# Altium project ac-control.PrjPcb
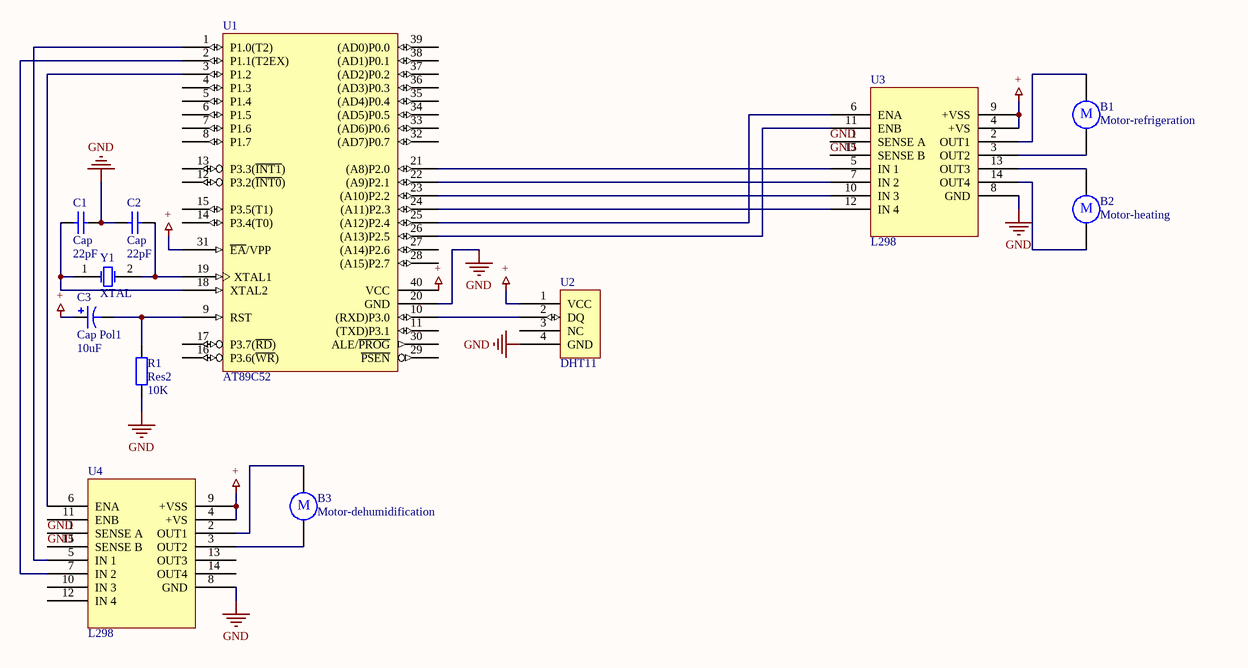
[diagram p0: ac-control-schematic.SchDoc]
1 sheet, 12 parts. Net scope: global (net labels, ports and power ports of the same name join across sheets).
Board file: ac-control-pcb.PcbDoc

## Sheet ac-control-schematic.SchDoc
size A4

### Parts
B1  Motor-refrigeration  [RB5-10.5]
B2  Motor-heating  [RB5-10.5]
B3  Motor-dehumidification  [RB5-10.5]
C1  Cap  value 22pF  [RAD-0.3]
C2  Cap  value 22pF  [RAD-0.3]
C3  Cap Pol1  value 10uF  [RB7.6-15]
R1  Res2  value 10K  [AXIAL-0.4]
U1  AT89C52  [DIP-40W]
U2  DHT11  [HDR1X4]
U3  L298  [L298]
U4  L298  [L298]
Y1  XTAL  [R38]

### Nets
+: C3.1 U1.31(~{EA}/VPP) U1.40(VCC) U2.1(VCC) U3.4(+VS) U3.9(+VSS) U4.4(+VS) U4.9(+VSS)
GND: C1.2 C2.1 R1.1 U1.20(GND) U2.4(GND) U3.1(SENSE_A) U3.8(GND) U3.15(SENSE_B) U4.1(SENSE_A) U4.8(GND) U4.15(SENSE_B)
NetB1_1: B1.1 U3.2(OUT1)
NetB1_2: B1.2 U3.3(OUT2)
NetB2_1: B2.1 U3.13(OUT3)
NetB2_2: B2.2 U3.14(OUT4)
NetB3_1: B3.1 U4.2(OUT1)
NetB3_2: B3.2 U4.3(OUT2)
NetC1_1: C1.1 U1.18(XTAL2) Y1.1(OSC1)
NetC2_2: C2.2 U1.19(XTAL1) Y1.2(OSC2)
NetC3_2: C3.2 R1.2 U1.9(RST)
NetU1_1: U1.1(P1.0(T2)) U4.5(IN_1)
NetU1_2: U1.2(P1.1(T2EX)) U4.7(IN_2)
NetU1_3: U1.3(P1.2) U4.6(ENA)
NetU1_10: U1.10((RXD)P3.0) U2.2(DQ)
NetU1_21: U1.21((A8)P2.0) U3.5(IN_1)
NetU1_22: U1.22((A9)P2.1) U3.7(IN_2)
NetU1_23: U1.23((A10)P2.2) U3.10(IN_3)
NetU1_24: U1.24((A11)P2.3) U3.12(IN_4)
NetU1_25: U1.25((A12)P2.4) U3.6(ENA)
NetU1_26: U1.26((A13)P2.5) U3.11(ENB)

Not connected (* = marked no-connect by the designer): U1 4(P1.3) 5(P1.4) 6(P1.5) 7(P1.6) 8(P1.7) 11((TXD)P3.1) 12(P3.2(~{INT0})) 13(P3.3(~{INT1})) 14(P3.4(T0)) 15(P3.5(T1)) 16(P3.6(~{WR})) 17(P3.7(~{RD})) 27((A14)P2.6) 28((A15)P2.7) 29(~{PSEN}) 30(ALE/~{PROG}) 32((AD7)P0.7) 33((AD6)P0.6) 34((AD5)P0.5) 35((AD4)P0.4) 36((AD3)P0.3) 37((AD2)P0.2) 38((AD1)P0.1) 39((AD0)P0.0); U2 3(NC); U4 10(IN_3) 11(ENB) 12(IN_4) 13(OUT3) 14(OUT4)

### Notes on the sheet
- (in symbol Motor) M

### Library data of the parts
B1-B3 = Motor: Motor, General Kind; Published: 24-Mar-1999; LatestRevisionDate: 17-Jul-2002; LatestRevisionNote: Re-released for DXP Platform.; PackageReference: RB5-10.5; Publisher: Altium Limited; PackageDescription: Capacitor (Radial); 2 Leads
C1 C2 = Cap: Capacitor; Published: 8-Jun-2000; LatestRevisionDate: 17-Jul-2002; LatestRevisionNote: Re-released for DXP Platform.; PackageReference: RAD-0.3; Publisher: Altium Limited; PackageDescription: Radial Cap, Thru-Hole; 2 Leads; 0.3 in Pin Spacing
C3 = Cap Pol1: Polarized Capacitor (Radial); Published: 8-Jun-2000; LatestRevisionDate: 17-Jul-2002; LatestRevisionNote: Re-released for DXP Platform.; PackageReference: RB7.6-15; Publisher: Altium Limited; PackageDescription: Polarized Capacitor (Radial); 2 Leads
R1 = Res2: Resistor; Published: 8-Jun-2000; LatestRevisionDate: 17-Jul-2002; LatestRevisionNote: Re-released for DXP Platform.; PackageReference: AXIAL-0.4; Publisher: Altium Limited; PackageDescription: Axial Device, Thru-Hole; 2 Leads; 0.4 in Pin Spacing
U1 = AT89C52: 8-Bit Microcontroller with 8K Flash ROM
U2 = Component_1
U3 U4 = L298N
Y1 = XTAL: Crystal Oscillator; Published: 8-Jun-2000; LatestRevisionDate: 17-Jul-2002; LatestRevisionNote: Re-released for DXP Platform.; PackageReference: R38; Publisher: Altium Limited; PackageDescription: Crystal, Thru-Hole; 2 Leads; Body 3.1 x 8.2 mm (Dia.xH)